# EasyEDA schematic EasyEDA Schematic.json
TITLE: Sheet_1; REV: 1.0; Date: 2021-03-05; Sheet: 1/1; Drawn By: Sayantan98; Company: ElectroPoint4u
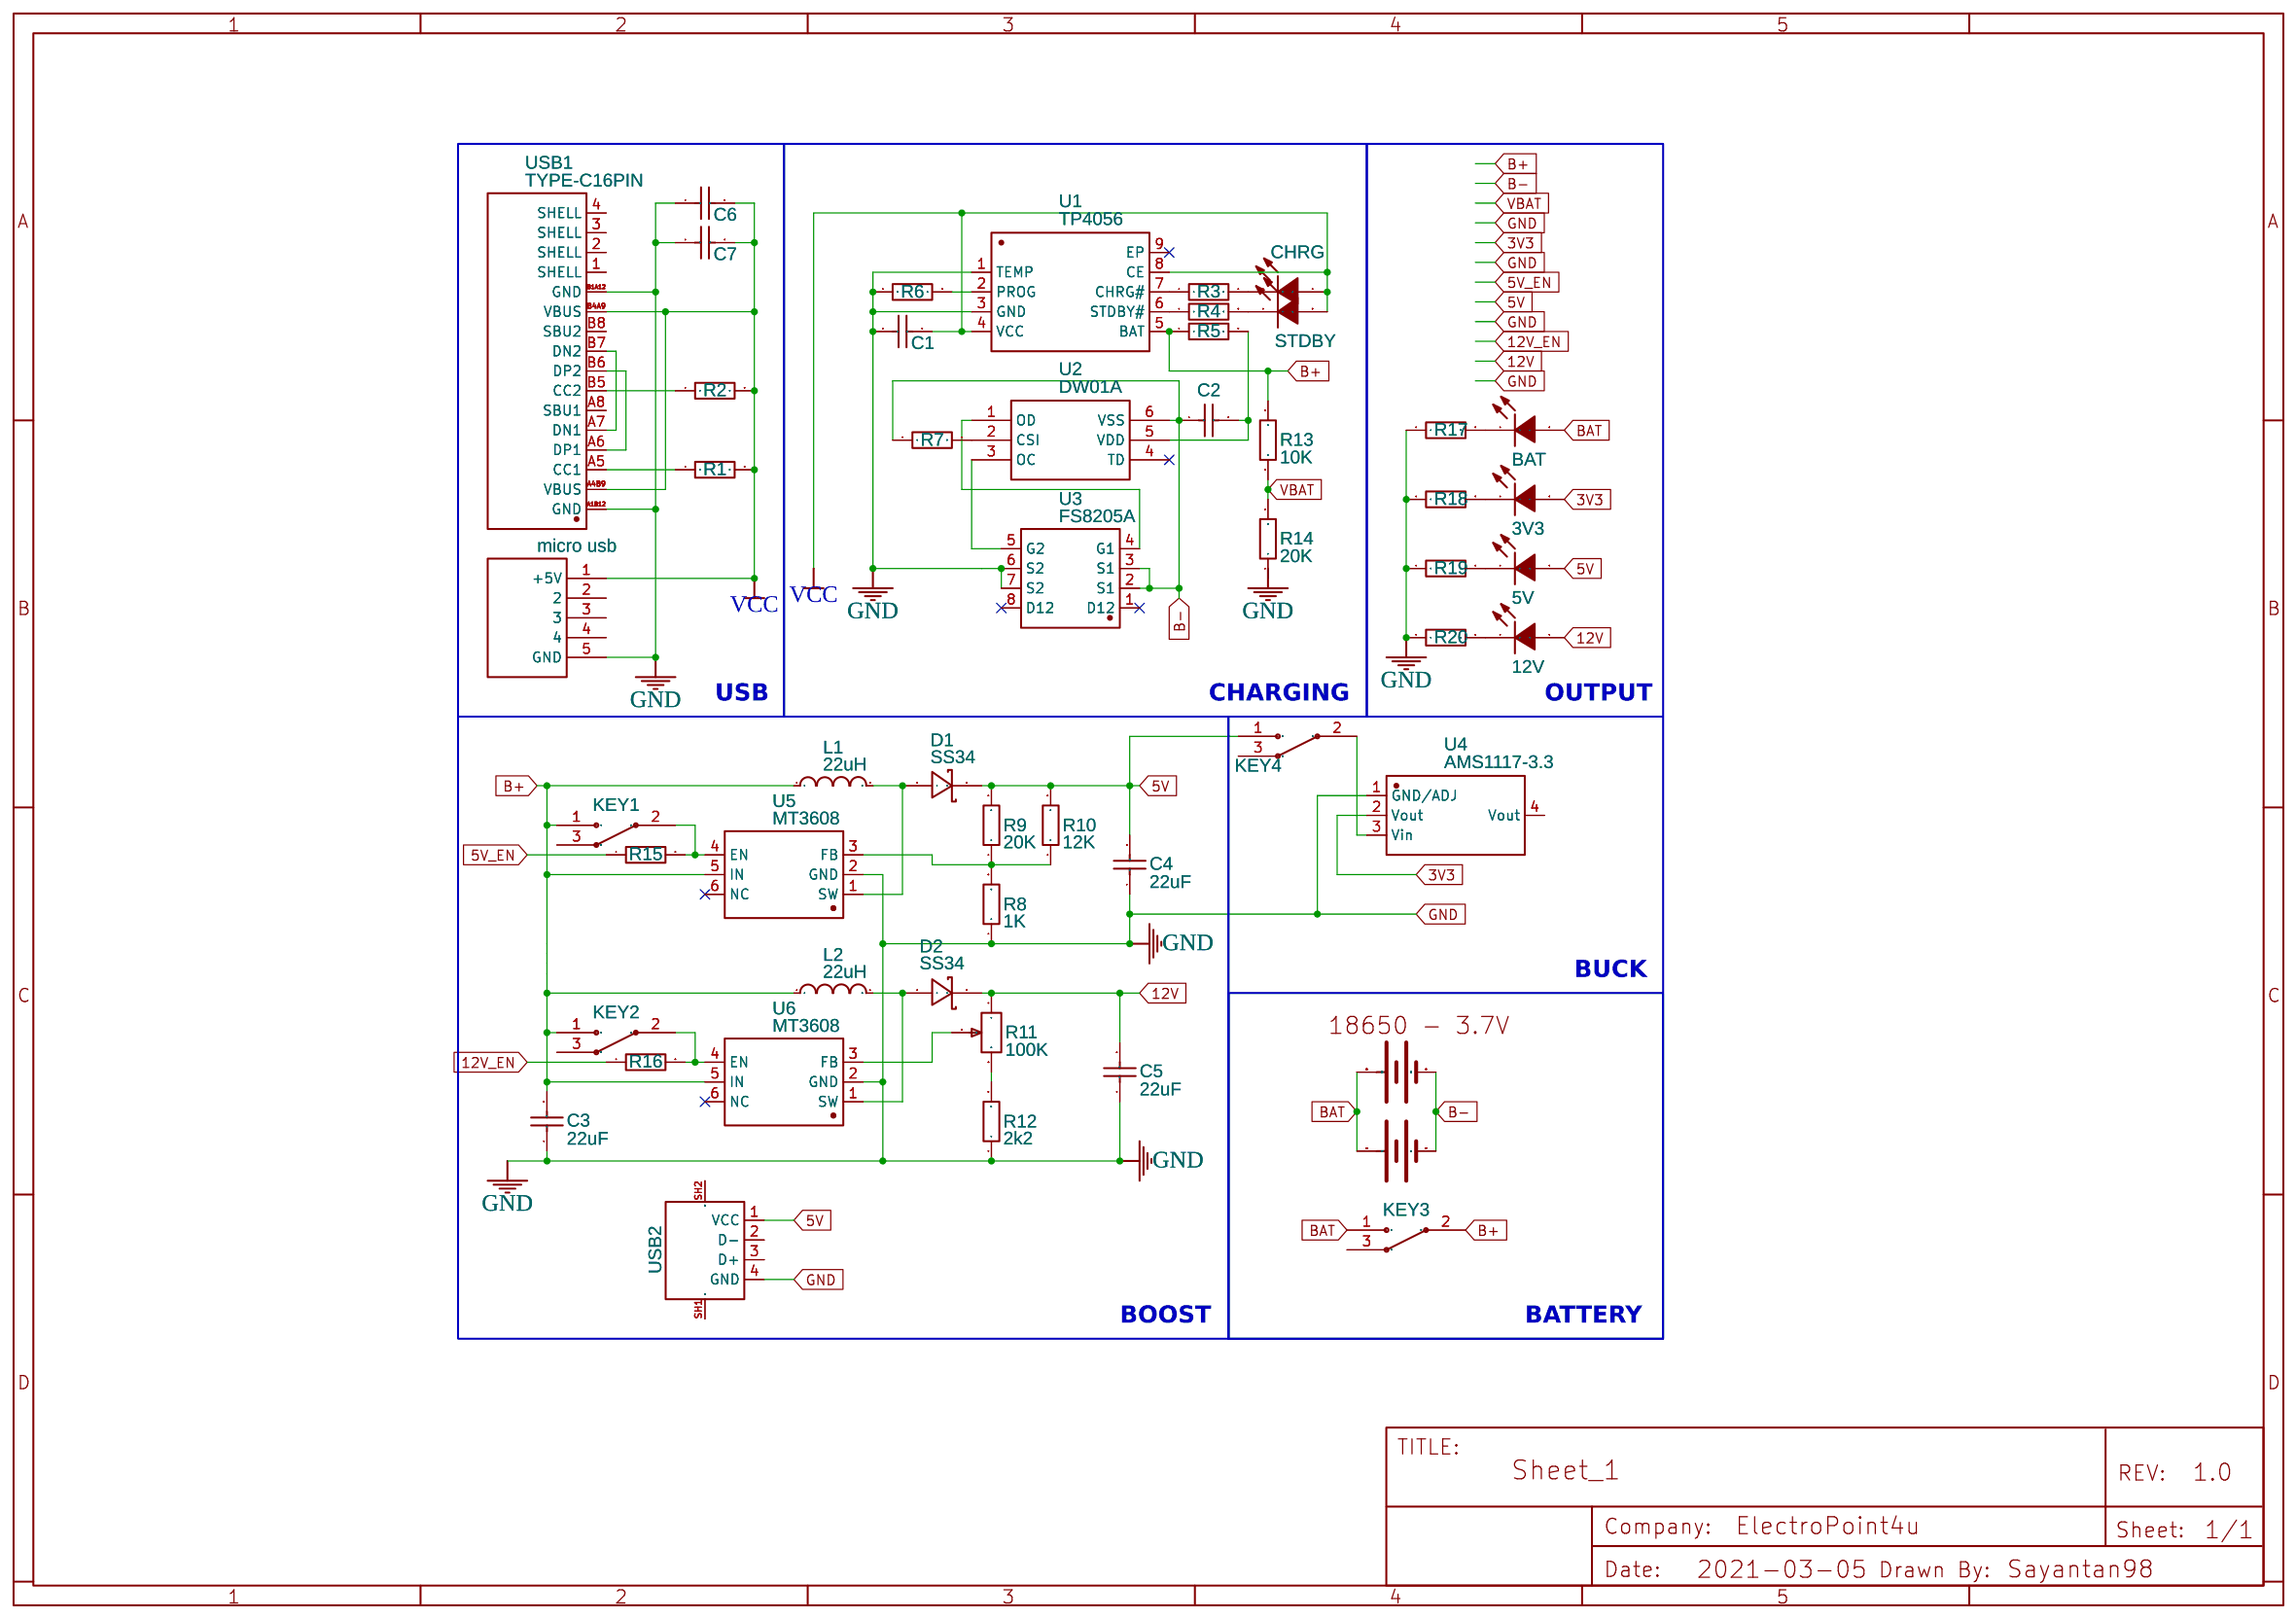
[diagram p0: schematic sheet]

## Parts
3.1V  18650  [18650-HOLDER]
3.2V  18650  [18650-HOLDER]
3V3  0805G (Green)  [LED0805-RD]
5V  0805G (Green)  [LED0805-RD]
12V  0805G (Green)  [LED0805-RD]
BAT  0805G (Green)  [LED0805-RD]
C1  10uF  [C0805]
C2  100nF  [C0805]
C3  22uF  [C1206]
C4  22uF  [C1206]
C5  22uF  [C1206]
C6  10uF  [C0805]
C7  1uF  [C0805]
CHRG  0805G (Green)  [LED0805-RD]
D1  SS34  [DO-214AC_L4.3-W2.7-LS5.3-RD]
D2  SS34  [DO-214AC_L4.3-W2.7-LS5.3-RD]
KEY1  MSK-11027 Toggle Switches  [SW-SMD_MSK-11027]
KEY2  MSK-11027 Toggle Switches  [SW-SMD_MSK-11027]
KEY3  MSK-11027 Toggle Switches  [SW-SMD_MSK-11027]
KEY4  MSK-11027 Toggle Switches  [SW-SMD_MSK-11027]
L1  22uH  [IND-SMD_L12.5-W12.5]
L2  22uH  [IND-SMD_L12.5-W12.5]
R1  5.1K  [R0805]
R2  5.1K  [R0805]
R3  1K  [R0805]
R4  1K  [R0805]
R5  100  [R0805]
R6  2K  [R0805]
R7  1K  [R0805]
R8  1K  [R0805]
R9  20K  [R0805]
R10  12K  [R0805]
R11  100K  [ADJ_RES]
R12  2k2  [R0805]
R13  10K  [R0805]
R14  20K  [R0805]
R15  100  [R0805]
R16  100  [R0805]
R17  1K  [R0805]
R18  1K  [R0805]
R19  1K  [R0805]
R20  1K  [R0805]
STDBY  0805G (Green)  [LED0805-RD]
U1  TP4056  [ESOP-8_L4.9-W3.9-P1.27-LS6.0-BL-EP]
U2  DW01A  [SOT-23-6_L2.9-W1.6-P0.95-LS2.8-BL]
U3  FS8205A  [TSSOP-8_L4.4-W3.5-P0.65-LS6.4-BL]
U4  AMS1117-3.3  [SOT-223-3_L6.5-W3.4-P2.30-LS7.0-BR]
U5  MT3608  [SOT-23-6_L2.9-W1.6-P0.95-LS2.8-BR]
U6  MT3608  [SOT-23-6_L2.9-W1.6-P0.95-LS2.8-BR]
USB1  TYPE-C16PIN  [USB-C-SMD_TYPE-C16PIN]
USB2  JTJ-USB-AF-08  [USB-A-TH__USB-AF-90]
USB3  micro usb  [MICRO-USB-18]

## Library data of the parts
3.1V 3.2V = 18650: Battery Holder; Contributor: Pauloscarello
3V3 5V 12V BAT CHRG STDBY = 0805G (Green): Supplier: LCSC; Manufacturer: KENTO; image: //image.lceda.cn/szlcsc/C2297.jpg; Supplier Part: C2297; SMT Type: Basic; JLCPCB SMD: Yes
C1 C6 C7 = CL21A106KAYNNNE: Supplier: LCSC; Manufacturer: SAMSUNG; Supplier Part: C15850; SMT Type: Basic; JLCPCB SMD: Yes
C2 = CL21B104JBCNNNC: Supplier: LCSC; Manufacturer: SAMSUNG; Supplier Part: C62912; SMT Type: Extend; JLCPCB SMD: Yes
C3-C5 = CL31A226KPHNNNE: Supplier: LCSC; Manufacturer: SAMSUNG; Supplier Part: C5672; LCSC Assembly: Yes; SMT Type: Extend
D1 D2 = SS34_C8678: Supplier: LCSC; Manufacturer: MDD; image: //image.lceda.cn/szlcsc/C8678.jpg; Supplier Part: C8678; LCSC Assembly: Yes; SMT Type: Basic
KEY1-KEY4 = MSK-11027 Toggle Switches: Supplier Part: C21381; Supplier: LCSC; Manufacturer: ReliaPro; image: http://image.lceda.cn/szlcsc/C21381.jpg
L1 L2 = SWRB1205S-220MT: Supplier: LCSC; Supplier Part: C169385; Manufacturer: Sunlord; Contributor: LCSC; LCSC Assembly: Yes; SMT Type: Extend
R1 R2 = 0805W8F5101T5E: Supplier: LCSC; Manufacturer: UniOhm; Supplier Part: C27834; SMT Type: Basic; JLCPCB SMD: Yes
R3 R4 R7 R17-R20 = 0805WAD1001T5E: Supplier: LCSC; Supplier Part: C169072; Manufacturer: Uniroyal Elec; Contributor: LCSC; SMT Type: Extend; JLCPCB SMD: Yes
R5 R15 R16 = 0805W8F1000T5E: Supplier: LCSC; Manufacturer: UniOhm; Supplier Part: C17408; SMT Type: Basic; JLCPCB SMD: Yes
R6 = 0805W8F2001T5E: Supplier: LCSC; Manufacturer: UniOhm; Supplier Part: C17604; SMT Type: Basic; JLCPCB SMD: Yes
R8 R12 = 0805W8F1001T5E: Supplier: LCSC; Manufacturer: UniOhm; LCSC Assembly: Yes; Supplier Part: C17513; SMT Type: Basic
R9 = 0805W8F2002T5E: Supplier: LCSC; Manufacturer: UniOhm; LCSC Assembly: Yes; Supplier Part: C4328; SMT Type: Basic
R10 = 0805W8F1202T5E: Supplier: LCSC; Manufacturer: UniOhm; LCSC Assembly: Yes; Supplier Part: C17444; SMT Type: Basic
R11 = POTENTIOMETER VARIABLE RESISTOR: Contributor: rhalf caacbay
R13 R14 = TC0550B1002T5E: Supplier: LCSC; Supplier Part: C141888; Manufacturer: Uniroyal Elec; Contributor: LCSC; LCSC Assembly: Yes; SMT Type: Extend
U1 = TP4056_C382139: Supplier: LCSC; Supplier Part: C382139; Manufacturer: TPOWER; Contributor: LCSC; SMT Type: Extend; JLCPCB SMD: Yes
U2 = DW01A: Supplier: LCSC; Manufacturer: FM; Supplier Part: C85680; SMT Type: Extend; JLCPCB SMD: Yes
U3 = FS8205A: Supplier: LCSC; Manufacturer: FORTUNE; image: //image.lceda.cn/szlcsc/C16052.jpg; Supplier Part: C16052; SMT Type: Basic; JLCPCB SMD: Yes
U4 = AMS1117-3.3: sourceId: dwIGgezVh; Supplier: LCSC; Manufacturer: AMS; image: //image.lceda.cn/szlcsc/C6186.jpg; Supplier Part: C6186; SMT Type: Basic; JLCPCB SMD: Yes
U5 U6 = MT3608: Supplier: LCSC; Manufacturer: AEROSEMI; Supplier Part: C84817; SMT Type: Extend; JLCPCB SMD: Yes
USB1 = TYPE-C16PIN: Supplier: LCSC; Supplier Part: C393939; Manufacturer: SHOU HAN; Contributor: LCSC
USB2 = JTJ-USB-AF-08: Supplier: LCSC; image: //image.lceda.cn/szlcsc/C2345.jpg; Contributor: LCSC; Supplier Part: C2345; LCSC Assembly: Yes; SMT Type: Extend
USB3 = micro usb: Contributor: MakeItBuddy

## Nets
3V3: 3V3.2(A) U4.2(Vout)
5V: 5V.2(A) C4.2 D1.1(K) KEY4.1 R9.2 R10.2 USB2.1(VCC)
5V_EN: R15.1
12V: 12V.2(A) C5.2 D2.1(K) R11.1
12V_EN: R16.1
GND: C1.1 C3.1 C4.1 C5.1 C6.1 C7.1 R6.1 R8.1 R12.1 R14.1 R17.1 R18.1 R19.1 R20.1 U1.1(TEMP) U1.3(GND) U3.6(S2) U3.7(S2) U4.1(GND/ADJ) U5.2(GND) U6.2(GND) USB1.A1B12(GND) USB1.B1A12(GND) USB2.4(GND) USB3.5(GND)
VBAT: R13.1 R14.2
VCC: C1.2 C6.2 C7.2 CHRG.2(A) R1.2 R2.2 STDBY.2(A) U1.4(VCC) U1.8(CE) USB1.A4B9(VBUS) USB1.B4A9(VBUS) USB3.1(+5V)
B+: C3.2 KEY1.1 KEY2.1 KEY3.2 L1.1 L2.1 R5.1 R13.2 U1.5(BAT) U5.5(IN) U6.5(IN)
B-: 3.1V.GND 3.2V.GND C2.1 R7.1 U2.6(VSS) U3.2(S1) U3.3(S1)
BAT: 3.1V.Positive 3.2V.Positive BAT.2(A) KEY3.1
Net-(3V3-1): 3V3.1(K) R18.2
Net-(5V-1): 5V.1(K) R19.2
Net-(12V-1): 12V.1(K) R20.2
Net-(BAT-1): BAT.1(K) R17.2
Net-(C2-2): C2.2 R5.2 U2.5(VDD)
Net-(CHRG-1): CHRG.1(K) R3.2
Net-(D1-2): D1.2(A) L1.2 U5.1(SW)
Net-(D2-2): D2.2(A) L2.2 U6.1(SW)
Net-(KEY1-2): KEY1.2 R15.2 U5.4(EN)
Net-(KEY2-2): KEY2.2 R16.2 U6.4(EN)
Net-(KEY4-2): KEY4.2 U4.3(Vin)
Net-(R1-1): R1.1 USB1.A5(CC1)
Net-(R2-1): R2.1 USB1.B5(CC2)
Net-(R3-1): R3.1 U1.7(CHRG#)
Net-(R4-1): R4.1 U1.6(STDBY#)
Net-(R4-2): R4.2 STDBY.1(K)
Net-(R6-2): R6.2 U1.2(PROG)
Net-(R7-2): R7.2 U2.2(CSI)
Net-(R8-2): R8.2 R9.1 R10.1 U5.3(FB)
Net-(R11-2): R11.2 U6.3(FB)
Net-(R11-3): R11.3 R12.2
Net-(U2-1): U2.1(OD) U3.4(G1)
Net-(U2-3): U2.3(OC) U3.5(G2)
Net-(USB1-A6): USB1.A6(DP1) USB1.B6(DP2)
Net-(USB1-A7): USB1.A7(DN1) USB1.B7(DN2)

Not connected (* = marked no-connect by the designer): KEY1 3; KEY2 3; KEY3 3; KEY4 3; U1 9(EP)*; U2 4(TD)*; U3 1(D12)* 8(D12)*; U4 4(Vout); U5 6(NC)*; U6 6(NC)*; USB1 1(SHELL) 2(SHELL) 3(SHELL) 4(SHELL) A8(SBU1) B8(SBU2); USB2 2(D-) 3(D+) SH1 SH2; USB3 2 3 4

## Notes on the sheet
- USB
- CHARGING
- OUTPUT
- BUCK
- BOOST
- BATTERY
